# EAGLE design F-Cable (EAGLE 9.0.1)
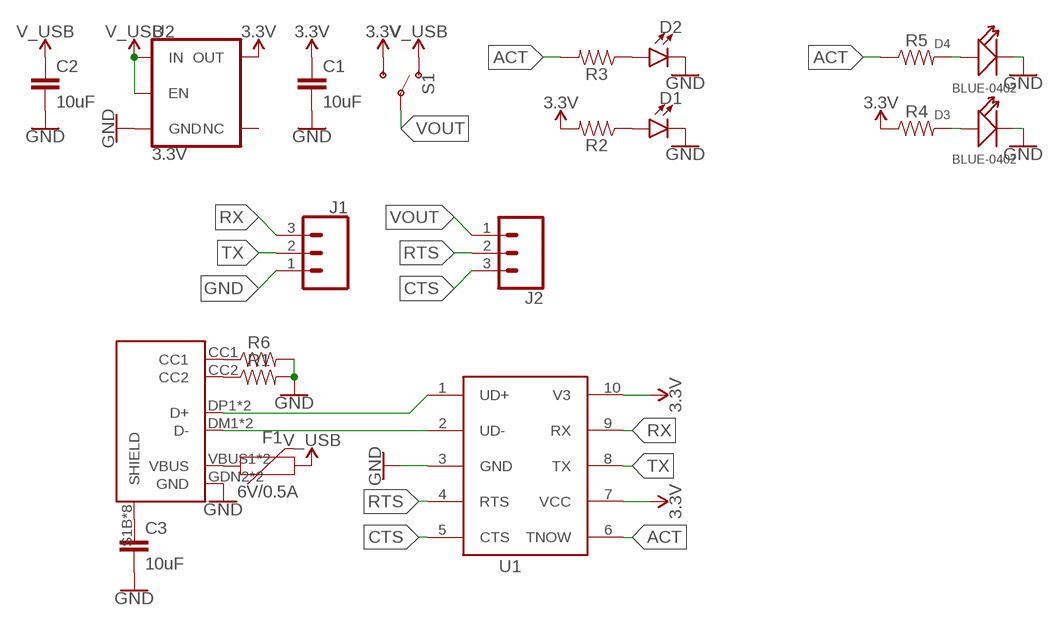
[diagram p0: schematic, sheet 1]

## Parts
C1  10uF  10UF-0603-6.3V-20%  [0603]
C2  10uF  10UF-0603-6.3V-20%  [0603]
C3  10uF  10UF-0603-6.3V-20%  [0603]
D1  LED0603  [LED-0603]
D2  LED0603  [LED-0603]
D3  BLUE-0402  SMD-LED-CLEAR-BLUE(0402)  [LED-0402]
D4  BLUE-0402  SMD-LED-CLEAR-BLUE(0402)  [LED-0402]
F1  6V/0.5A  PPTC_HALF-AMP  [1206]
J1  CONN_03SMD_RA_MALE  [1X03_SMD_RA_MALE]
J2  CONN_03SMD_RA_MALE  [1X03_SMD_RA_MALE]
R1  RESISTOR0603  [0603]
R2  RESISTOR0603  [0603]
R3  RESISTOR0603  [0603]
R4  RESISTOR0402  [0402]
R5  RESISTOR0402  [0402]
R6  RESISTOR0603  [0603]
S1  SWITCH-SPDT-SMD-RIGHT-ANGLE  [SWITCH_SPST_SMD_A]
U1  CH340ESMD  [MSOP10]
U2  3.3V  V_REG_AP2112K-3.3V  [SOT23-5]
U$1  USB-C_USB2ONLY-HORZ_F  [USB-C_12PIN_HORZ-F]

## Nets
3.3V: C1.1 R2.2 R4.1 S1.3(S) U1.7(VCC) U1.10(V3) U2.5(OUT)
ACT: R3.2 R5.1 U1.6(TNOW)
CTS: J2.3 U1.5(CTS)
DM: U1.2(UD-) U$1.DM1(D-) U$1.DM2(D-)
DP: U1.1(UD+) U$1.DP1(D+) U$1.DP2(D+)
GND: C1.2 C2.2 C3.2 D1.C D2.C D3.- D4.- J1.1 R1.2 R6.2 U1.3(GND) U2.2(GND) U$1.GDN2(GND) U$1.GND1(GND)
N$1: D1.A R2.1
N$2: D2.A R3.1
N$3: D4.+ R5.2
N$4: D3.+ R4.2
N$5: R6.1 U$1.CC1
N$6: R1.1 U$1.CC2
RTS: J2.2 U1.4(RTS)
RX: J1.3 U1.9(RX)
SHIELD: C3.1 U$1.S1B(SHIELD) U$1.S1T(SHIELD) U$1.S2B(SHIELD) U$1.S2T(SHIELD) U$1.S3B(SHIELD) U$1.S3T(SHIELD) U$1.S4B(SHIELD) U$1.S4T(SHIELD)
TX: J1.2 U1.8(TX)
V_USB: C2.1 F1.2 S1.1(O) U2.1(IN) U2.3(EN)
VOUT: J2.1 S1.2(P)
VUSB: F1.1 U$1.VBUS1(VBUS) U$1.VBUS2(VBUS)
Unconnected: U2.4(NC)

## Library data of the parts
C1-C3 = SparkFun-Capacitors:10UF: 10.0µF ceramic capacitors A capacitor is a passive two-terminal electrical component used to store electrical energy temporarily in an electric field.; PROD_ID: CAP-11015
D1 D2 = SparkFun-LED:LED: LED (Generic) Standard schematic elements and footprints for 5mm, 3mm, 1206, and 0603 sized LEDs. Generic LEDs with no color specified.
D3 D4 = Seeed-LED:SMD-LED-CLEAR-BLUE(0402): 304090075; MPN: BL-HB337A-AV-TRB
F1 = SparkFun-Fuses:PPTC: Resettable Fuse PPTC Resettable Fuse. Really a sort of resistor with a polymeric positive temperature coefficient whose resistance increases dramatically with an increase in temperature. When heated by the power passing through the resistance rises causing the current to be limited, protecting the circuit. This is achieved by the transition of the polymer from a crystalline to an amorphous state where the conductive carbon separates breaking the conductive pathways found in the cool crystalline structure. When a PPTC cools back down it resumes conducting letting the circuit turn back on. SparkFun Products: SparkFun RedBoard - Programmed with Arduino <https://www.sparkfun.com/products/12757> Pro Micro - 5V/16MHz <https://www.sparkfun.com/products/12640> Arduino Pro 328 - 5V/16MHz <https://www.sparkfun.com/products/10915> MP3 Trigger <https://www.sparkfun.com/products/13720>; PROD_ID: RES-08585
J1 J2 = SparkFun-Connectors:CONN_03: Multi connection point. Often used as Generic Header-pin footprint for 0.1 inch spaced/style header connections On any of the 0.1 inch spaced packages, you can populate with these: Break Away Headers - Straight <https://www.sparkfun.com/products/116> (PRT-00116) Break Away Male Headers - Right Angle <https://www.sparkfun.com/products/553> (PRT-00553) Female Headers <https://www.sparkfun.com/products/115> (PRT-00115) Break Away Headers - Machine Pin <https://www.sparkfun.com/products/117> (PRT-00117) Break Away Female Headers - Swiss Machine Pin <https://www.sparkfun.com/products/743> (PRT-00743) Stackable Header - 3 Pin (Female, 0.1") <https://www.sparkfun.com/products/13875> (PRT-13875) For SCREWTERMINALS and SPRING TERMINALS visit here: Screw Terimnals on SparkFun.com <https://www.sparkfun.com/search/results?term=Screw+Terminals> (5mm/3.5mm/2.54mm spacing) This device is also useful as a general connection point to wire up your design to another part of your project. Our various solder wires solder well into these plated through hole pads. Hook-Up Wire - Assortment (Stranded, 22 AWG) <https://www.sparkfun.com/products/11375> (PRT-11375) Hook-Up Wire - Assortment (Solid Core, 22 AWG) <https://www.sparkfun.com/products/11367> (PRT-11367) View the entire wire category on our website here <https://www.sparkfun.com/categories/141> Special notes: Molex polarized connector foot print use with SKU : PRT-08232 with associated crimp pins and housings.; PROD_ID: CONN-10925
R1-R6 = SparkFun-Resistors:RESISTOR: Generic Resistor Package
S1 = SparkFun-Switches:SWITCH-SPDT: Single Pole, Double Throw (SPDT) Switch Single-pole, double-throw (SPDT) switch. Variant Overview SMD-AYZ0202 Surface Mount DPDT Switch <https://www.sparkfun.com/products/597> (COM-00597) Used on e.g. LilyPad Arduino USB - ATmega32U4 Board <https://www.sparkfun.com/products/12049> PTH-11.6X4.0MM SPDT Mini Power Switch <https://www.sparkfun.com/products/102> (COM-00102) Used on e.g. SparkFun Simon Says - Through-Hole Soldering Kit <https://www.sparkfun.com/products/10547> (KIT-10547) PTH-11.6X4.0MM-KIT KIT version of SPDT Mini Power Switch - Simplifies soldering by removing tStop of switch pins - only one side can be soldered. PTH-11.6X4.0MM-LOCK LOCK version of SPDT Mini Power Switch - Offset pins hold switch in place for easier soldering. SMD-RIGHT-ANGLE Surface Mount Right Angle Switch <https://www.sparkfun.com/products/10860> (COM-10860) Used on e.g. SparkFun ESP8266 Thing <https://www.sparkfun.com/products/13231>; PROD_ID: SWCH-10651; SF_SKU: COM-10860
U1 = CH340E:CH340E: WCH.CN/CH340E See DataSheet： wch.cn <http://www.wch.cn/downloads/CH340DS1_PDF.html>
U2 = SparkFun-IC-Power:V_REG_AP2112: AP2112 - 600mA CMOS LDO Regulator w/ Enable The AP2112 is CMOS process low dropout linear regulator with enable function, the regulator delivers a guaranteed 600mA (min.) continuous load current. Features Output Voltage Accuracy: ±1.5% Output Current: 600mA (Min.) Foldback Short Current Protection: 50mA Enable Function to Turn ON/OFF VOUT Low Dropout Voltage (3.3V): 250mV (Typ.) @IOUT=600mA Excellent Load Regulation: 0.2%/A (Typ.) Excellent Line Regulation: 0.02%/V (Typ.) Low Quiescent Current: 55μA (Typ.) Low Standby Current: 0.01μA (Typ.) Low Output Noise: 50μVRMS PSRR: 100Hz -65dB, 1kHz -65dB OTSD Protection Stable with 1.0μF Flexible Cap: Ceramic, Tantalum and Aluminum Electrolytic Operation Temperature Range: -40°C to 85°C ESD: MM 400V, HBM 4000V; PROD_ID: VREG-12457
U$1 = 12voltman:USB-C_USB2ONLY

## Board
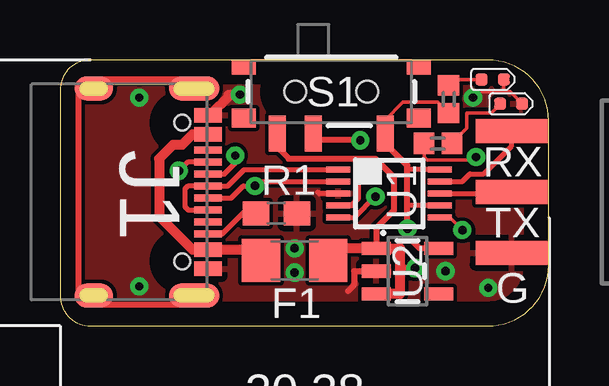
[diagram p1: board, top side]
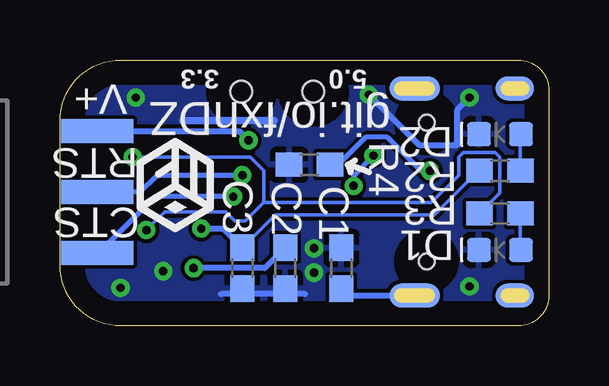
[diagram p2: board, bottom side, seen from below]

Size 20.36 x 11.1 mm. Coordinates in mm from the lower left corner, seen from the top.
Outline: 0,9.83 0,1.27 arc90 1.27,0 17.82,0 arc90 20.36,2.54 20.36,8.56 arc90 17.82,11.1 1.27,11.1 arc90 0,9.83
Copper layers (1*16): Top 0.035mm / dielectric 1.5mm / Bottom 0.035mm
Design rules "default *": minimum track width 6mil, minimum drill 0.35mm, track to track 6mil, track to pad 6mil, pad to pad 6mil, via to via 6mil, smd to smd 6mil, copper to edge 40mil, drill to drill 6mil, minimum pad ring 10mil, minimum via ring 8mil, stop-mask expansion 4mil, vias tented up to drill 14mil, thermal gap 10mil

### Footprints (pad centres in the part's own frame; a part is rotated, then mirrored left to right if it is on the bottom)
0603 = smd 1.1 x 1: 1 -0.85,0; 2 0.85,0
LED-0603 = smd 1 x 1: A -0.877,0; C 0.877,0
LED-0402 = smd 0.5 x 0.5: + -0.463,0; - 0.463,0
1206 = smd 1.6 x 1.8: 1 -1.4,0; 2 1.4,0
1X03_SMD_RA_MALE = smd 1 x 3: 1 -2.54,5; 2 0,5; 3 2.54,5
0402 = smd 0.85 x 0.9: 1 -0.58,0; 2 0.58,0
SWITCH_SPST_SMD_A = smd 0.7 x 1.5: 1 -2.25,-1.75; 2 -0.75,-1.75; 3 2.25,-1.75 | smd 1 x 0.6: GND1 -3.65,1; GND3 3.65,1 | smd 1 x 0.8: GND2 -3.65,-1.1; GND4 3.65,-1.1 | hole 0.9: -1.5,0; 1.5,0
MSOP10 = smd 1 x 0.25: 1 -2.113,1; 2 -2.113,0.5; 3 -2.113,0; 4 -2.113,-0.5; 5 -2.113,-1; 6 2.113,-1; 7 2.113,-0.5; 8 2.113,0; 9 2.113,0.5; 10 2.113,1
SOT23-5 = smd 0.55 x 1.2: 1 -0.95,-1.3; 2 0,-1.3; 3 0.95,-1.3; 4 0.95,1.3; 5 -0.95,1.3
USB-C_12PIN_HORZ-F = smd 0.3 x 1.15: CC1 1.25,-0.575; CC2 -1.75,-0.575; DM1 -0.25,-0.575; DM2 0.75,-0.575; DP1 0.25,-0.575; DP2 -0.75,-0.575; SBU1 -1.25,-0.575; SBU2 1.75,-0.575 | smd 0.6 x 1.15: GDN2 3.2,-0.575; GND1 -3.2,-0.575; VBUS1 -2.4,-0.575; VBUS2 2.4,-0.575 | smd 1 x 2.1 bottom: S1B -4.32,0; S4B 4.32,0 | smd 1 x 2.1: S1T -4.32,0; S4T 4.32,0 | smd 1 x 1.6 bottom: S2B -4.32,4.18; S3B 4.32,4.18 | smd 1 x 1.6: S2T -4.32,4.18; S3T 4.32,4.18 | hole 0.65: -2.89,0.5; 2.89,0.5

### Placement (x,y rotation side)
C1  12.76,2.41 270 bottom
C2  10.99,2.41 270 bottom
C3  8.64,2.41 90 bottom
D1  2.03,8 180 bottom
D2  2.03,3.17 180 bottom
D3  18.03,10.29 0 top
D4  18.8,9.27 0 top
F1  9.78,2.73 0 top
J1  23.81,5.59 90 top
J2  23.81,5.59 270 bottom
R1  9.02,4.7 0 top
R2  2.03,6.48 180 bottom
R3  2.03,4.7 180 bottom
R4  16.19,9.46 90 top
R5  15.75,7.62 0 top
R6  9.97,6.73 180 bottom
S1  11.3,9.78 0 top
U1  13.72,5.52 0 top
U2  14.48,2.29 270 top
U$1  5.59,5.59 90 top

### Tracks (layer width: path | path; a pad name or v marks a point on that pad's centre or on a via)
3.3V  (via drill 0.35)
  Top 0.15: R4.1 15.74,9.34 14.29,9.34 13.55,8.6 S1.3
  Top 0.203: U1.7 14.48,5.02 14.48,5.08 | U1.10 14.48,6.52 14.48,6.35
  Top 0.254: 15.52,3.24 U2.5 14.99,3.24 14.48,3.75 v14.48,4.06 14.48,5.08 14.48,6.35 14.48,6.7 13.55,7.62 S1.3
  Top 0.406: 15.39,3.24 U2.5
  Bottom 0.152: C1.1 11.39,4.64 4.76,4.64 2.92,6.48
  Bottom 0.254: 2.92,6.48 R2.2 | v14.48,4.06 13.56,4.06 C1.1
ACT  (via drill 0.35)
  Top 0.15: v17.34,7.05 17.21,6.92 15.3,6.92 15.18,7.05 R5.1
  Top 0.152: U1.6 16.24,4.52 v16.76,4
  Bottom 0.15: 11.87,5.14 11.87,6.48 12.45,7.05 v17.34,7.05
  Bottom 0.152: R3.2 2.03,5.55 2.03,7.05 2.22,7.24 3.56,7.24 3.75,7.05 3.75,6.29 4.89,5.14 11.87,5.14 12.64,4.38 13.08,4.38 13.46,4.76 16,4.76 v16.76,4
CTS  (via drill 0.35)
  Top 0.203: U1.5 12.27,4.52 v13.14,5.4
  Bottom 0.203: v13.14,5.4 16.4,5.4 18.75,3.05 J2.3
DM  (via drill 0.35)
  Top 0.203: U$1.DM1 7.13,5.34 7.64,5.84 v8.13,5.84 8.31,6.02 U1.2 | U$1.DM2 6.85,6.34 7.3,6.79 v7.3,7.11
  Bottom 0.203: v7.3,7.11 8.13,6.29 v8.13,5.84
DP
  Top 0.152: 6.35,5.84 U$1.DP1
  Top 0.203: U$1.DP2 5.35,4.84 5.21,4.98 5.21,5.71 5.33,5.84 U$1.DP1 6.98,5.84 7.67,6.52 U1.1
GND  (via drill 0.35)
  Top 0.152: D4.- 18.75,9.78 18.48,9.78 | 18.48,9.78 17.59,9.78 | D3.- 18.5,9.8 18.48,9.78
  Top 0.203: U1.3 10.79,5.52 10.73,5.59
  Top 0.254: U2.2 12.26,2.29 12.26,1.71 12,1.46
  Top 0.406: 7.03,9.65 7.11,9.65 | 7.11,9.65 7.37,9.65 | U$1.GDN2 6.25,8.79 7.11,9.65
  Bottom 0.254: v7.49,9.65 5.4,7.56 3.81,7.56 3.81,9.02 v3.3,9.53 | 10.16,1.33 13.65,1.33
  Bottom 0.305: 11.43,8.57 15.24,8.57
  other vias: 3.3,1.65 9.78,3.24 9.78,2.22 16.07,2.29 17.84,1.59 17.21,9.53
  pour Bottom: 22.86,11.43 0,11.43 0,0 22.86,0
  pour Top: 0,11.43 22.86,11.43 22.86,0 0,0
N$1
  Bottom 0.152: R2.1 1.18,7.97 D1.A
N$2
  Bottom 0.152: D2.A 1.18,2.95 R3.1
N$3
  Top 0.15: D4.+ 17.97,8.89 16.95,8.89 16.95,8.25 R5.2
N$4
  Top 0.15: D3.+ 16.19,10.29 R4.2
N$5  (via drill 0.35)
  Top 0.203: U$1.CC1 5.31,6.84 v4.95,6.48
  Bottom 0.203: v4.95,6.48 5.33,6.48 6.73,7.87 7.62,7.87 8.76,6.73 R6.1
N$6
  Top 0.203: U$1.CC2 6.76,3.84 7.87,4.95 R1.1
RTS  (via drill 0.35)
  Top 0.203: U1.4 12.14,5.02 12.45,5.33 12.45,5.97 v12.76,6.29
  Bottom 0.203: v12.76,6.29 15.24,6.29 15.68,6.29 16.32,6.29 16.38,6.22 17.02,5.59 J2.2
RX
  Top 0.203: 16.5,6.02 U1.9 16.76,6.02 17.08,6.35 17.65,6.35 18.81,7.51 J1.3
SHIELD  (4 unrouted)
  Top 0.254: U$1.S4B 5.21,10.29 1.79,10.29 U$1.S3T 0.76,9.91 0.76,1.27 U$1.S2T 1.79,0.89 5.21,0.89 U$1.S1T
  Bottom 0.152: 4.7,1.27 U$1.S1T
  Bottom 0.254: C3.1 8.34,1.27 U$1.S1T
TX
  Top 0.203: U1.8 18.75,5.52 J1.2
V_USB  (via drill 0.35)
  Top 0.254: 8.9,7.87 S1.1 | 9.05,7.84 S1.1 | 12.95,3.27 U2.1 13.18,4.1 13.91,4.83 13.91,6.22 13.14,6.99 12.7,6.99 9.53,6.99 8.89,7.62 9.05,7.78 S1.1 | v14.8,2.41 14.16,2.41
  Top 0.406: U2.3 14.16,1.34 14.16,2.41 14.16,3.24 U2.1 11.62,3.24 F1.2 11.65,3.26
  Bottom 0.254: C2.1 11.84,2.41 v14.8,2.41
VOUT  (via drill 0.35)
  Top 0.203: S1.2 10.65,8.13
  Top 0.254: S1.2 | S1.2 10.64,7.94 | v12.51,7.75 10.62,7.75 S1.2
  Bottom 0.254: J2.1 12.89,8.13 v12.51,7.75
VUSB
  Top 0.406: F1.1 8.25,3.19 U$1.VBUS1 5.51,3.19 4.13,4.57 4.13,6.99 4.7,7.56 5.08,7.56 5.51,7.99 U$1.VBUS2

### Text on the board
tPlace: S1 | RX | R1 | U1 | J1 | TX | U2 | G | F1
bPlace: 5.0 | 3.3 | git.io/fxhDZ | V+ | D2 | R4 | RTS | R2 | R3 | C1 | C2 | C3 | CTS | D1